# EAGLE design random-keypad-interface-board-v01 (EAGLE 7.7.0)
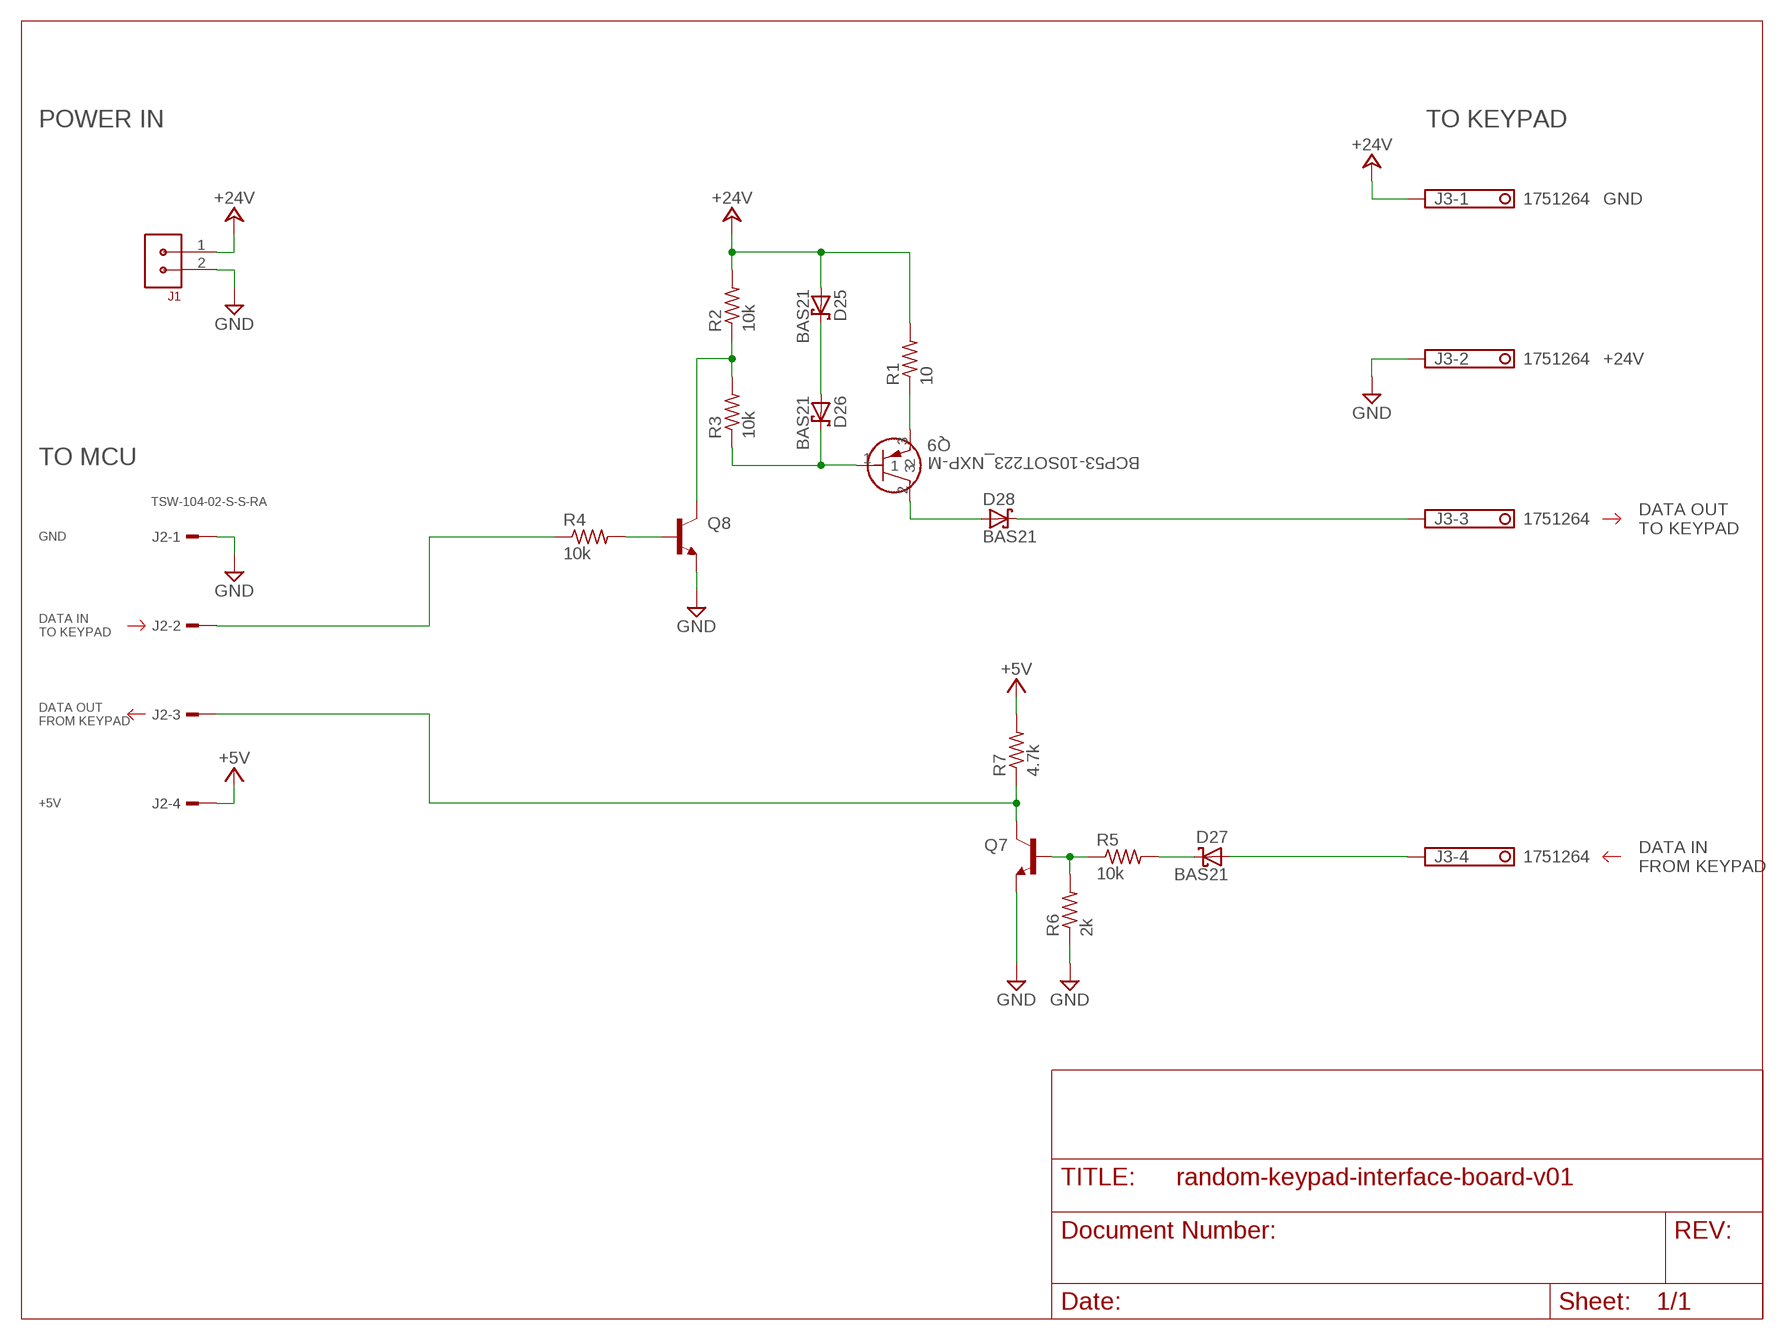
[diagram p0: schematic, sheet 1]

## Parts
D25  BAS21  BAS40  [SOT23]
D26  BAS21  BAS40  [SOT23]
D27  BAS21  BAS40  [SOT23]
D28  BAS21  BAS40  [SOT23]
J1  CON-3.81MM-1X2-PHOENIX  [CON-PHOENIX-3.81-1X2-RA]
J2  TSW-104-02-S-S-RA  [TSW-104-02-S-S-RA]
J3  1751264  [1751264]
Q7  BC817-40-NPN-SOT23-BEC  [SOT23-BEC]
Q8  BC817-40-NPN-SOT23-BEC  [SOT23-BEC]
Q9  BCP53-10SOT223_NXP-M  [SOT223_NXP-M]
R1  10  R-US_R0603  [R0603]
R2  10k  R-US_R0603  [R0603]
R3  10k  R-US_R0603  [R0603]
R4  10k  R-US_R0603  [R0603]
R5  10k  R-US_R0603  [R0603]
R6  2k  R-US_R0603  [R0603]
R7  4.7k  R-US_R0603  [R0603]

## Nets
+5V: J2.4 R7.2
+24V: D25.1(A) J1.1 J3.1 R1.2 R2.2
GND: J1.2 J2.1 J3.2 Q7.E Q8.E R6.1
N$1: D28.1(A) Q9.2
N$2: D28.3(C) J3.3
N$3: Q8.B R4.2
N$4: D25.3(C) D26.1(A)
N$5: D26.3(C) Q9.1 R3.1
N$6: Q9.3 R1.1
N$7: Q8.C R2.1 R3.2
N$8: Q7.B R5.1 R6.2
N$9: J2.2 R4.1
N$10: D27.3(C) R5.2
N$11: D27.1(A) J3.4
N$12: J2.3 Q7.C R7.1

## Notes on the sheet
- POWER IN | TO KEYPAD
- GND
- +24V
- TO MCU
- DATA OUT
  TO KEYPAD
- GND
- DATA IN
  TO KEYPAD
- DATA OUT
  FROM KEYPAD
- +5V
- DATA IN
  FROM KEYPAD

## Library data of the parts
D25-D28 = diode:BAS40: Silicon Schottky Diodes General-purpose diode for high-speed switching
J1 = 0GlenConnectors:CON-3.81MM-1X2-PHOENIX
J2 = con-samtec:TSW-104-02-S-S: THROUGH-HOLE .025" SQ POST HEADER Source: Samtec TSW.pdf; OC_FARNELL: unknown; OC_NEWARK: unknown
J3 = con-phoenix-350:1751264: MKDS 1/ 4-3,5 Printklemme Nennstrom: 10 A Bemessungsspannung: 160 V Raster: 3,5 mm Polzahl: 4 Montageart: Löten Anschlussart: Schraubanschluss Anschlussrichtung vom Leiter zur Platine: 0° Source: http://eshop.phoenixcontact.com .. 1751264.pdf; MPN: 1751264; OC_FARNELL: unknown; OC_NEWARK: 10R0934
Q7 Q8 = transistor:*-NPN-: NPN Transistror BF959 corrected 2008.03.06
Q9 = BCP53-10:BCP53-10; COPYRIGHT: Copyright (C) 2021 Ultra Librarian. All rights reserved.; DIGI-KEY_PART_NUMBER_1: 2721-BCP53-10-ND; DIGI-KEY_PART_NUMBER_2: 2796-BCP53-10-ND; DIGI-KEY_PART_NUMBER_3: 568-6104-1-ND; DIGI-KEY_PART_NUMBER_4: 568-6104-2-ND; DIGI-KEY_PART_NUMBER_5: 568-6104-6-ND; MANUFACTURER_PART_NUMBER: BCP53-10; MFR_NAME: NXP
R1-R7 = resistor:R-US_: RESISTOR, American symbol

## Board
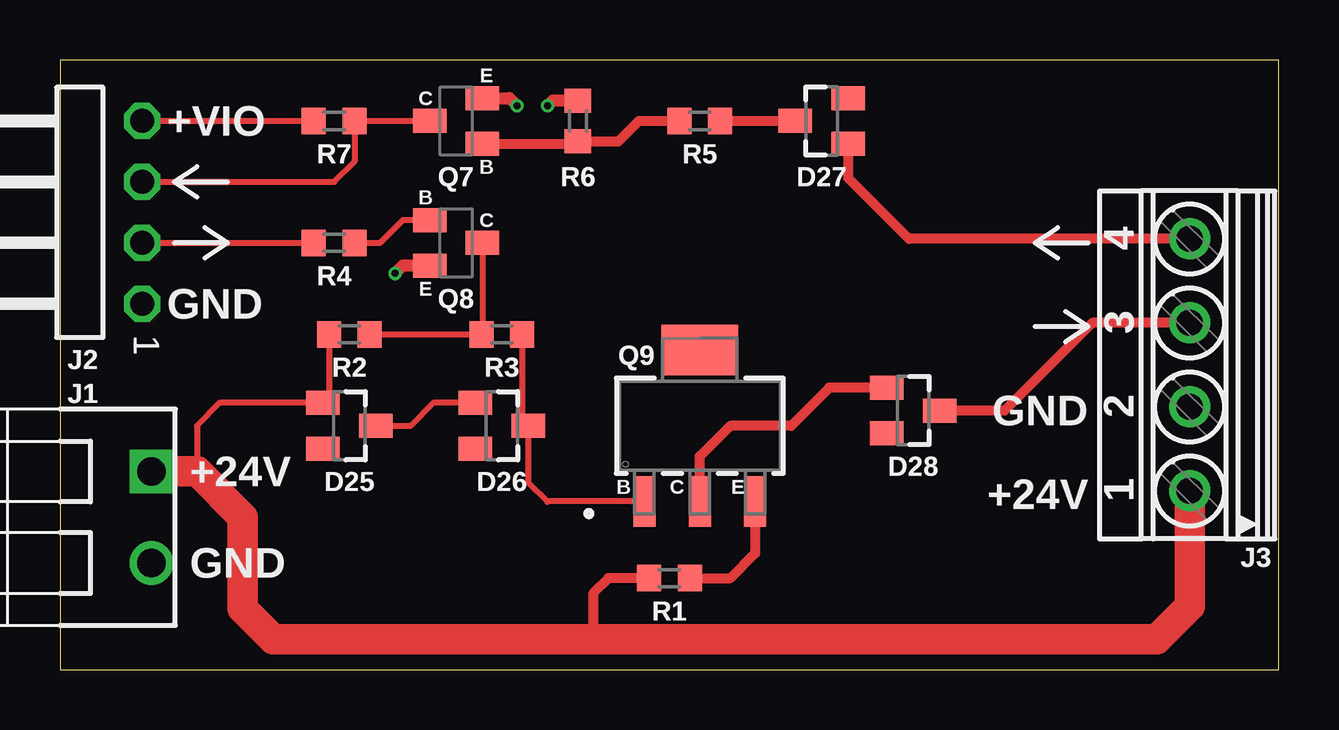
[diagram p1: board, top side]
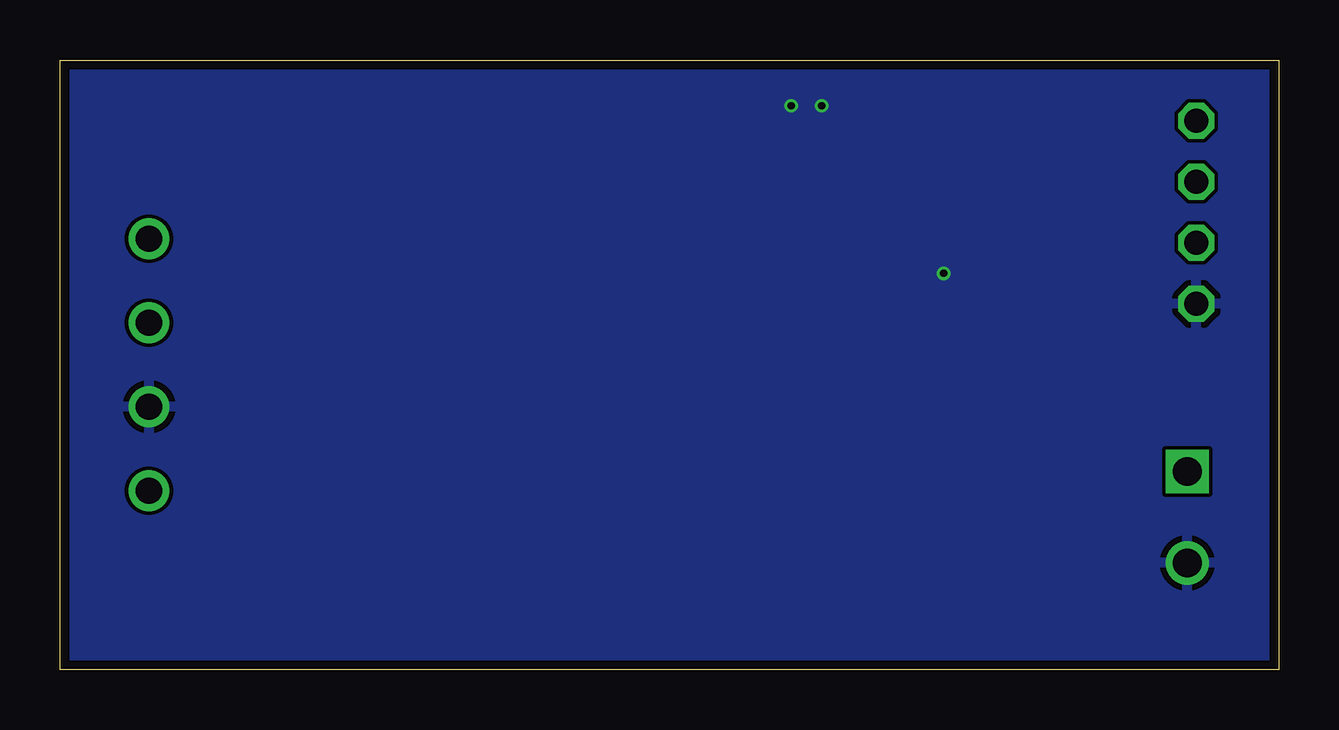
[diagram p2: board, bottom side, seen from below]

Size 50.8 x 25.4 mm. Coordinates in mm from the lower left corner, seen from the top.
Outline: 0,0 50.8,0 50.8,25.4 0,25.4 0,0
Copper layers (1*16): Top 0.035559375mm / dielectric 1.6mm / Bottom 0.035559375mm
Design rules "oshpark-2layer-2018": minimum track width 6mil, minimum drill 10mil, track to track 6mil, track to pad 6mil, pad to pad 6mil, via to via 6mil, smd to smd 6mil, copper to edge 15mil, drill to drill 6mil, minimum pad ring 5mil, minimum via ring 5mil, stop-mask expansion 2.5mil, vias tented up to drill 0mil, thermal gap 10mil

### Footprints (pad centres in the part's own frame; a part is rotated, then mirrored left to right if it is on the bottom)
SOT23 = smd 1 x 1.4: 1 -0.95,-1.1; 2 0.95,-1.1; 3 0,1.1
CON-PHOENIX-3.81-1X2-RA = drill 1.2 square: 1 0,0 | drill 1.2: 2 3.81,0
TSW-104-02-S-S-RA = drill 1 pad 1.5 octagon: 1 3.81,1.524; 2 1.27,1.524; 3 -1.27,1.524; 4 -3.81,1.524
1751264 = drill 1.1 pad 1.7: 1 -5.25,-0.1; 2 -1.75,-0.1; 3 1.75,-0.1; 4 5.25,-0.1
SOT23-BEC = smd 1 x 1.4: B -0.95,-1.1; C 0,1.1; E 0.95,-1.1
SOT223_NXP-M = smd 0.914 x 2.108: 1 -2.3,-3.15; 2 0,-3.15; 3 2.3,-3.15 | smd 3.2 x 2.108: 4 0,3.15
R0603 = smd 1 x 1.1: 1 -0.85,0; 2 0.85,0

### Placement (x,y rotation side)
D25  12.06,10.16 270 top
D26  18.41,10.16 270 top
D27  31.75,22.86 90 top
D28  35.56,10.79 270 top
J1  3.81,8.26 270 top
J2  1.91,19.05 270 top
J3  46.99,12.7 90 top
Q7  16.51,22.86 90 top
Q8  16.51,17.78 270 top
Q9  26.67,10.16 0 top
R1  25.4,3.81 180 top
R2  12.06,13.97 180 top
R3  18.41,13.97 180 top
R4  11.43,17.78 0 top
R5  26.67,22.86 0 top
R6  21.59,22.86 270 top
R7  11.43,22.86 180 top

### Tracks (layer width: path | path; a pad name or v marks a point on that pad's centre or on a via)
+5V
  Top 0.254: J2.4 R7.2
+24V
  Top 0.254: R2.2 11.21,11.36 D25.1 6.67,11.11 5.71,10.16 5.71,8.26
  Top 0.406: R1.2 22.86,3.81 22.23,3.17 22.23,1.27
  Top 1.27: J1.1 5.71,8.26 7.62,6.35 7.62,2.54 8.89,1.27 22.23,1.27 45.72,1.27 47.09,2.64 J3.1
GND  (via drill 0.3)
  Top 0.508: Q7.E 18.73,23.81 v19.05,23.5 | R6.1 20.54,23.71 v20.32,23.5 | Q8.E 14.29,16.83 v13.97,16.51
  pour Bottom (isolate 0.152): 0,0 50.8,0 50.8,25.4 0,25.4
N$1
  Top 0.406: Q9.2 26.67,8.89 27.94,10.16 30.48,10.16 32.06,11.74 D28.1
N$2
  Top 0.406: J3.3 43.02,14.45 39.37,10.79 D28.3
N$3
  Top 0.254: R4.2 13.34,17.78 14.29,18.73 Q8.B
N$4
  Top 0.254: D25.3 14.61,10.16 15.55,11.11 D26.1
N$5
  Top 0.254: R3.1 19.27,10.41 D26.3 19.52,7.79 20.32,6.99 20.34,7.01 Q9.1
N$6
  Top 0.406: R1.1 27.94,3.81 28.97,4.84 Q9.3
N$7
  Top 0.254: R2.1 R3.2 17.61,14.02 Q8.C
N$8
  Top 0.406: Q7.B 21.49,21.91 R6.2 23.28,22.01 24.13,22.86 R5.1
N$9
  Top 0.254: J2.2 R4.1
N$10
  Top 0.406: R5.2 D27.3
N$11
  Top 0.406: D27.1 32.85,20.49 35.39,17.95 J3.4
N$12
  Top 0.254: J2.3 11.43,20.32 12.28,21.17 R7.1 Q7.C

### Text on the board
tValues: E | C | B | B | C | E | B | C | E
_tsilk: E | C | +VIO | R7 | R5 | Q7 | B | R6 | D27 | B | C | R4 | 4 | E | Q8 | GND | 3 | J2 | R2 | R3 | Q9 | J1 | GND | 2 | D28 | +24V | D25 | D26 | B | C | E | +24V | 1 | J3 | GND | R1